# Altium schematic sheet USB.SchDoc: USB
size A4; Author: Joao Guimaraes; Organization: Altium Limited; Address1: L3, 12a Rodborough Rd; Address2: Frenchs Forest; Address3: NSW; Address4: Australia 2086; Revision: 1.0.0
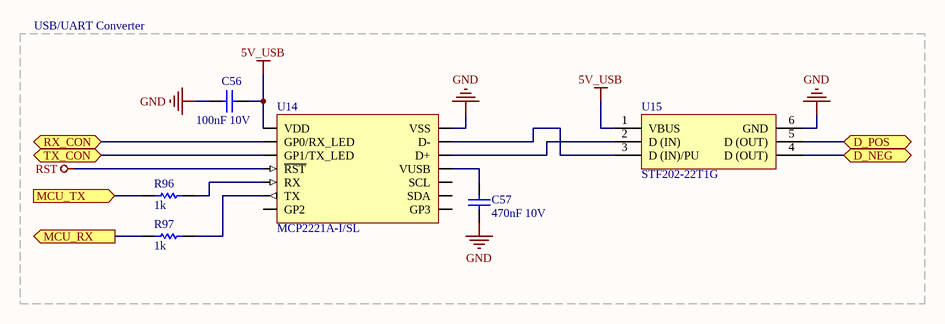
[diagram p0: USB.SchDoc]

## Parts
C56  100nF 10V  [0402]
C57  470nF 10V  [1608[0603]]
R96  1k  [6-0805_M]
R97  1k  [6-0805_M]
U14  MCP2221A-I/SL  [SOIC14_N]
U15  STF202-22T1G  [SOP6]

## Blocks framed on the sheet
USB/UART Converter: C56 C57 R96 R97 U14 U15

## Ports
D_NEG (bidir), D_POS (bidir), MCU_RX (out), MCU_TX (in), RX_CON, TX_CON

## Nets
5V_USB: C56.2 U14.1(VDD) U15.1(VBUS)
GND: C56.1 C57.1 U14.14(VSS) U15.6(GND)
RST: U14.4(~{RST})
D_NEG: U15.4(D_(OUT)) ; port D_NEG
D_POS: U15.5(D_(OUT)) ; port D_POS
MCU_RX: R97.2 ; port MCU_RX
MCU_TX: R96.2 ; port MCU_TX
RX_CON: U14.2(GP0/RX_LED) ; port RX_CON
TX_CON: U14.3(GP1/TX_LED) ; port TX_CON
NetC57_2: C57.2 U14.11(VUSB)
NetR96_1: R96.1 U14.5(RX)
NetR97_1: R97.1 U14.6(TX)
NetU14_12: U14.12(D-) U15.3(D_(IN)/PU)
NetU14_13: U14.13(D+) U15.2(D_(IN))

Not connected (* = marked no-connect by the designer): U14 7(GP2) 8(GP3) 9(SDA) 10(SCL)

## Notes on the sheet
- Title:
- Project:
- Date:
- Author:
- Version:
- File:

## Library data of the parts
C56 = Cap: Capacitor; PartNumber: CAP.100n.10V.20%.SMD.0402; Manufacturer: Wurth; ClassName: USB; Price: 0.015; Supplier: Mouser
C57 = Cap: Capacitor; PartNumber: CAP.470n.10V.20%.SMD.0603; Manufacturer: Vishay; ClassName: USB; Price: 0.15; Supplier: Mouser
R96 R97 = Res: Resistor; PartNumber: RES.1K.1/8W.5%.SMD.0805; Manufacturer: Yageo; ClassName: USB; Price: 0.012; Supplier: Mouser
U14 = MCP2221A-I/SL: USB Interface IC USB 2.0 to I2C Converter with GPIO; Manufacturer: Microchip; ClassName: USB; PartNumber: MCP2221A-I/SL; Price: 2.27; Supplier: Mouser
U15 = STF202-22T1G: Manufacturer: ON Semiconductor; ClassName: USB; PartNumber: STF202-22T1G; Price: 0.54; Supplier: Mouser